# Altium schematic sheet 輸出輸入擴充模組_20240808.SchDoc
size A4
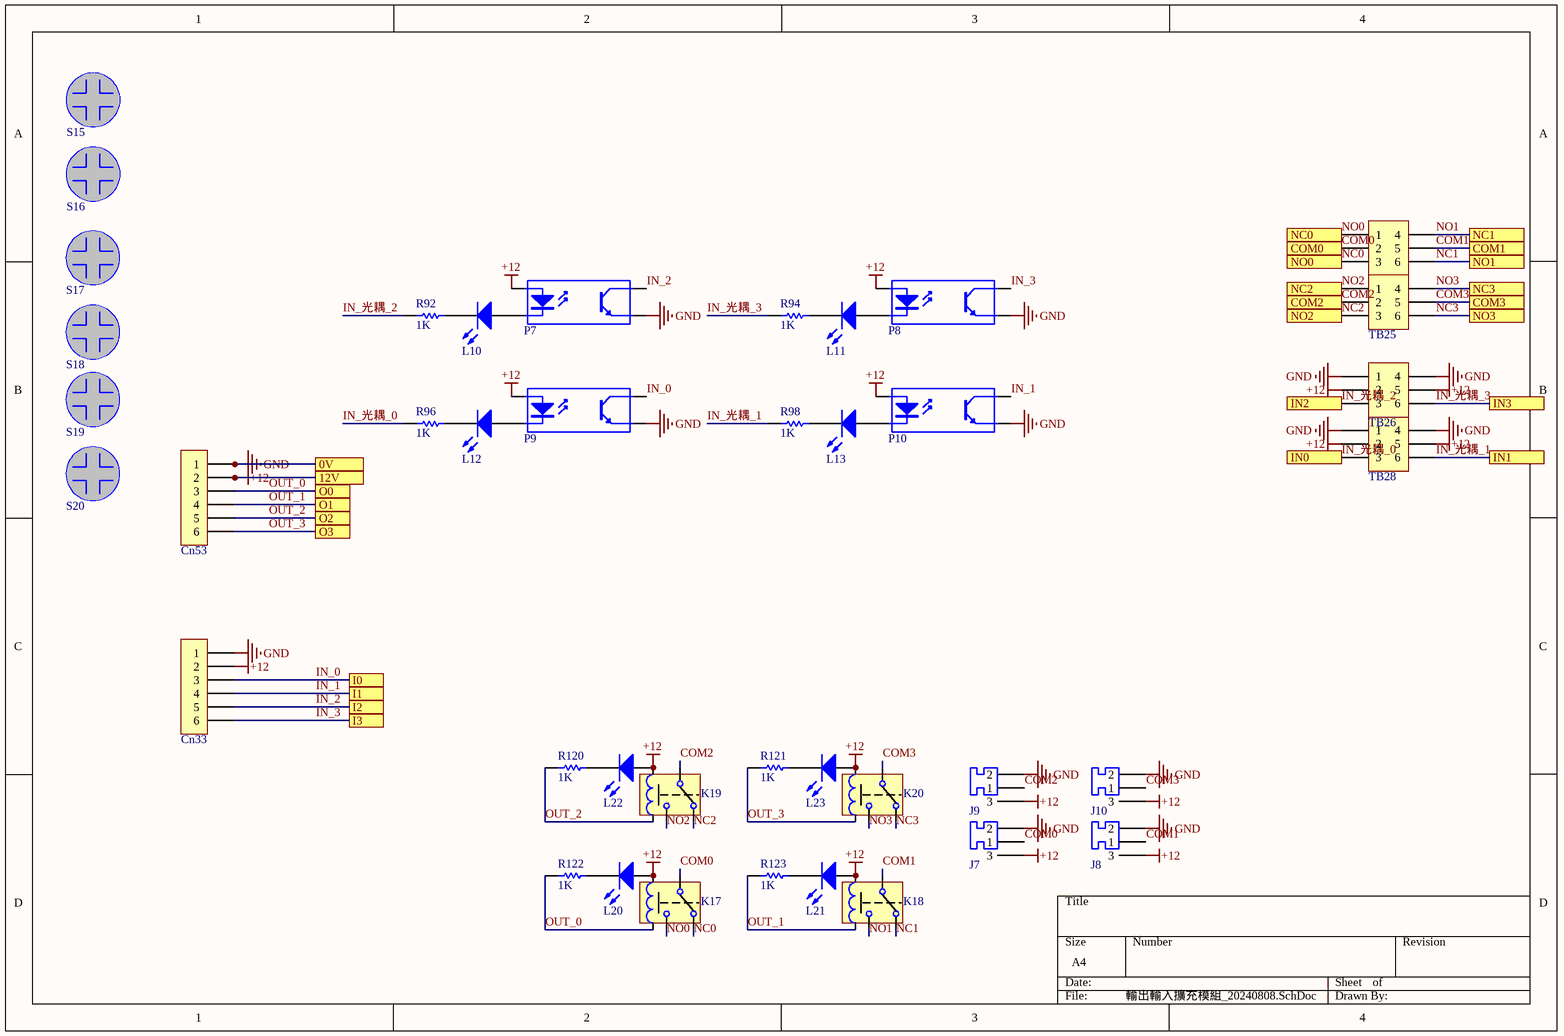
[diagram p0: 輸出輸入擴充模組_20240808.SchDoc]

## Parts
Cn33  KF2510-6  [Connector_KF2510-6A]  (value not drawn)
Cn53  KF2510-6  [Connector_KF2510-6A]  (value not drawn)
J7  Jumper(3P)  [Bypass_Jumper(3P)]  (value not drawn)
J8  Jumper(3P)  [Bypass_Jumper(3P)]  (value not drawn)
J9  Jumper(3P)  [Bypass_Jumper(3P)]  (value not drawn)
J10  Jumper(3P)  [Bypass_Jumper(3P)]  (value not drawn)
K17  41F-1Z-A  [RELAY-HF41F-012-ZST]  (value not drawn)
K18  41F-1Z-A  [RELAY-HF41F-012-ZST]  (value not drawn)
K19  41F-1Z-A  [RELAY-HF41F-012-ZST]  (value not drawn)
K20  41F-1Z-A  [RELAY-HF41F-012-ZST]  (value not drawn)
L10  紅  [LED-3mm]  (value not drawn)
L11  紅  [LED-3mm]  (value not drawn)
L12  紅  [LED-3mm]  (value not drawn)
L13  紅  [LED-3mm]  (value not drawn)
L20  紅  [LED-3mm]  (value not drawn)
L21  紅  [LED-3mm]  (value not drawn)
L22  紅  [LED-3mm]  (value not drawn)
L23  紅  [LED-3mm]  (value not drawn)
P7  PC817  [PC817]  (value not drawn)
P8  PC817  [PC817]  (value not drawn)
P9  PC817  [PC817]  (value not drawn)
P10  PC817  [PC817]  (value not drawn)
R92  1K  [Res_1/4]
R94  1K  [Res_1/4]
R96  1K  [Res_1/4]
R98  1K  [Res_1/4]
R120  1K  [Res_1/4]
R121  1K  [Res_1/4]
R122  1K  [Res_1/4]
R123  1K  [Res_1/4]
S15  M3  [Screw M3]  (value not drawn)
S16  M3  [Screw M3]  (value not drawn)
S17  M3  [Screw M3]  (value not drawn)
S18  M3  [Screw M3]  (value not drawn)
S19  M3  [Screw M3]  (value not drawn)
S20  M3  [Screw M3]  (value not drawn)
TB25  KF2EDGRT-5.08_6P  [Terminal block(KF2EDGRT-3.81_6P)]  (value not drawn)
TB26  KF2EDGRT-5.08_6P  [Terminal block(KF2EDGRT-3.81_6P)]  (value not drawn)
TB27  KF2EDGRT-5.08_6P  [Terminal block(KF2EDGRT-3.81_6P)]  (value not drawn)
TB28  KF2EDGRT-5.08_6P  [Terminal block(KF2EDGRT-3.81_6P)]  (value not drawn)

## Ports
0V, 12V, COM0, COM1, COM2, COM3, I0, I1, I2, I3, IN0, IN1, IN2, IN3, NC0, NC1, NC2, NC3, NO0, NO1, NO2, NO3, O0, O1, O2, O3

## Nets
+12: Cn33.2 Cn53.2 J7.3 J8.3 J9.3 J10.3 K17.4(A1) K18.4(A1) K19.4(A1) K20.4(A1) L20.2(A) L21.2(A) L22.2(A) L23.2(A) P7.1(A) P8.1(A) P9.1(A) P10.1(A) TB26.2 TB26.5 TB28.2 TB28.5 ; port 12V
GND: Cn33.1 Cn53.1 J7.2 J8.2 J9.2 J10.2 P7.3(E) P8.3(E) P9.3(E) P10.3(E) TB26.1 TB26.4 TB28.1 TB28.4 ; port 0V
COM0: J7.1 K17.1(COM) TB27.2 ; port COM0
COM1: J8.1 K18.1(COM) TB27.5 ; port COM1
COM2: J9.1 K19.1(COM) TB25.2 ; port COM2
COM3: J10.1 K20.1(COM) TB25.5 ; port COM3
IN_0: Cn33.3 P9.4(C) ; port I0
IN_1: Cn33.4 P10.4(C) ; port I1
IN_2: Cn33.5 P7.4(C) ; port I2
IN_3: Cn33.6 P8.4(C) ; port I3
IN_光耦_0: R96.1 TB28.3 ; port IN0
IN_光耦_1: R98.1 TB28.6 ; port IN1
IN_光耦_2: R92.1 TB26.3 ; port IN2
IN_光耦_3: R94.1 TB26.6 ; port IN3
NC0: K17.3(NC) TB27.3 ; port NO0
NC1: K18.3(NC) TB27.6 ; port NO1
NC2: K19.3(NC) TB25.3 ; port NO2
NC3: K20.3(NC) TB25.6 ; port NO3
NO0: K17.2(NO) TB27.1 ; port NC0
NO1: K18.2(NO) TB27.4 ; port NC1
NO2: K19.2(NO) TB25.1 ; port NC2
NO3: K20.2(NO) TB25.4 ; port NC3
OUT_0: Cn53.3 K17.5(A2) R122.1 ; port O0
OUT_1: Cn53.4 K18.5(A2) R123.1 ; port O1
OUT_2: Cn53.5 K19.5(A2) R120.1 ; port O2
OUT_3: Cn53.6 K20.5(A2) R121.1 ; port O3
NetL10_1: L10.1(K) R92.2
NetL10_2: L10.2(A) P7.2(K)
NetL11_1: L11.1(K) R94.2
NetL11_2: L11.2(A) P8.2(K)
NetL12_1: L12.1(K) R96.2
NetL12_2: L12.2(A) P9.2(K)
NetL13_1: L13.1(K) R98.2
NetL13_2: L13.2(A) P10.2(K)
NetL20_1: L20.1(K) R122.2
NetL21_1: L21.1(K) R123.2
NetL22_1: L22.1(K) R120.2
NetL23_1: L23.1(K) R121.2

## Library data of the parts
Cn33 Cn53 = Contact(6P): 接線端子
J7-J10 = Bypass_Jumper(3P): 跳線帽
K17-K20 = Relay: 繼電器
L10-L13 L20-L23 = LED
P7-P10 = PC817: 光耦
R92 R94 R96 R98 R120-R123 = Res: 電阻
S15-S20 = Screw: 螺絲(非焊接元件)
TB25-TB28 = Terminal block(6P): 端子台